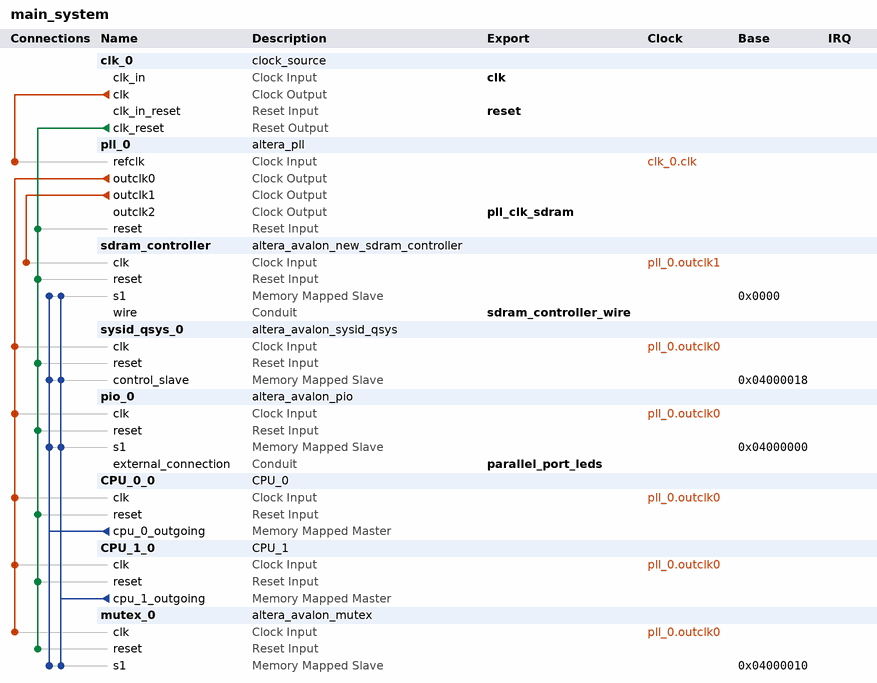
[diagram p0: system contents]
# Platform Designer (Qsys) system main_system, Cyclone V 5CSEMA5F31C6
# Parameters at their usual value, and those the tool derives, are not listed.
package require -exact qsys 18.0
create_system main_system
set_project_property DEVICE_FAMILY {Cyclone V}
set_project_property DEVICE 5CSEMA5F31C6

add_instance clk_0 clock_source 18.0
set_instance_parameter_value clk_0 clockFrequency 50000000

add_instance pll_0 altera_pll 18.0
set_instance_parameter_value pll_0 gui_device_speed_grade 1
set_instance_parameter_value pll_0 gui_number_of_clocks 3
set_instance_parameter_value pll_0 gui_operation_mode normal
set_instance_parameter_value pll_0 gui_output_clock_frequency0 50.0
set_instance_parameter_value pll_0 gui_output_clock_frequency1 100.0
set_instance_parameter_value pll_0 gui_output_clock_frequency2 100.0
set_instance_parameter_value pll_0 gui_phase_shift2 -3758
set_instance_parameter_value pll_0 gui_pll_mode {Integer-N PLL}
set_instance_parameter_value pll_0 gui_reference_clock_frequency 50.0
set_instance_parameter_value pll_0 gui_use_locked false

add_instance sdram_controller altera_avalon_new_sdram_controller 18.0
set_instance_parameter_value sdram_controller TAC 5.4
set_instance_parameter_value sdram_controller TRCD 15.0
set_instance_parameter_value sdram_controller TRP 15.0
set_instance_parameter_value sdram_controller casLatency 3
set_instance_parameter_value sdram_controller columnWidth 10
set_instance_parameter_value sdram_controller dataWidth 16
set_instance_parameter_value sdram_controller generateSimulationModel false
set_instance_parameter_value sdram_controller model single_Micron_MT48LC4M32B2_7_chip
set_instance_parameter_value sdram_controller numberOfBanks 4
set_instance_parameter_value sdram_controller numberOfChipSelects 1
set_instance_parameter_value sdram_controller powerUpDelay 100.0
set_instance_parameter_value sdram_controller refreshPeriod 7.8125
set_instance_parameter_value sdram_controller rowWidth 13

add_instance sysid_qsys_0 altera_avalon_sysid_qsys 18.0
set_instance_parameter_value sysid_qsys_0 id 0

add_instance pio_0 altera_avalon_pio 18.0
set_instance_parameter_value pio_0 direction Output
set_instance_parameter_value pio_0 width 10

add_instance CPU_0_0 CPU_0 1.0

add_instance CPU_1_0 CPU_1 1.0

add_instance mutex_0 altera_avalon_mutex 18.0

# connections
add_connection clk_0.clk pll_0.refclk clock
add_connection pll_0.outclk0 CPU_0_0.clk clock
add_connection pll_0.outclk0 CPU_1_0.clk clock
add_connection pll_0.outclk0 mutex_0.clk clock
add_connection pll_0.outclk0 pio_0.clk clock
add_connection pll_0.outclk0 sysid_qsys_0.clk clock
add_connection pll_0.outclk1 sdram_controller.clk clock
add_connection clk_0.clk_reset CPU_0_0.reset reset
add_connection clk_0.clk_reset CPU_1_0.reset reset
add_connection clk_0.clk_reset mutex_0.reset reset
add_connection clk_0.clk_reset pio_0.reset reset
add_connection clk_0.clk_reset pll_0.reset reset
add_connection clk_0.clk_reset sdram_controller.reset reset
add_connection clk_0.clk_reset sysid_qsys_0.reset reset
add_connection CPU_0_0.cpu_0_outgoing mutex_0.s1 avalon
set_connection_parameter_value CPU_0_0.cpu_0_outgoing/mutex_0.s1 baseAddress 0x04000010
add_connection CPU_0_0.cpu_0_outgoing pio_0.s1 avalon
set_connection_parameter_value CPU_0_0.cpu_0_outgoing/pio_0.s1 baseAddress 0x04000000
add_connection CPU_0_0.cpu_0_outgoing sdram_controller.s1 avalon
set_connection_parameter_value CPU_0_0.cpu_0_outgoing/sdram_controller.s1 baseAddress 0x0000
add_connection CPU_0_0.cpu_0_outgoing sysid_qsys_0.control_slave avalon
set_connection_parameter_value CPU_0_0.cpu_0_outgoing/sysid_qsys_0.control_slave baseAddress 0x04000018
add_connection CPU_1_0.cpu_1_outgoing mutex_0.s1 avalon
set_connection_parameter_value CPU_1_0.cpu_1_outgoing/mutex_0.s1 baseAddress 0x04000010
add_connection CPU_1_0.cpu_1_outgoing pio_0.s1 avalon
set_connection_parameter_value CPU_1_0.cpu_1_outgoing/pio_0.s1 baseAddress 0x04000000
add_connection CPU_1_0.cpu_1_outgoing sdram_controller.s1 avalon
set_connection_parameter_value CPU_1_0.cpu_1_outgoing/sdram_controller.s1 baseAddress 0x0000
add_connection CPU_1_0.cpu_1_outgoing sysid_qsys_0.control_slave avalon
set_connection_parameter_value CPU_1_0.cpu_1_outgoing/sysid_qsys_0.control_slave baseAddress 0x04000018

# exported interfaces
add_interface clk clock sink
set_interface_property clk EXPORT_OF clk_0.clk_in
add_interface parallel_port_leds conduit end
set_interface_property parallel_port_leds EXPORT_OF pio_0.external_connection
add_interface pll_clk_sdram clock source
set_interface_property pll_clk_sdram EXPORT_OF pll_0.outclk2
add_interface reset reset sink
set_interface_property reset EXPORT_OF clk_0.clk_in_reset
add_interface sdram_controller_wire conduit end
set_interface_property sdram_controller_wire EXPORT_OF sdram_controller.wire

set_interconnect_requirement {$system} qsys_mm.clockCrossingAdapter HANDSHAKE
set_interconnect_requirement {$system} qsys_mm.enableEccProtection FALSE
set_interconnect_requirement {$system} qsys_mm.insertDefaultSlave FALSE
set_interconnect_requirement {$system} qsys_mm.maxAdditionalLatency 1

save_system main_system.qsys
